# EAGLE schematic ElectricalLoads (EAGLE 9.5.1)
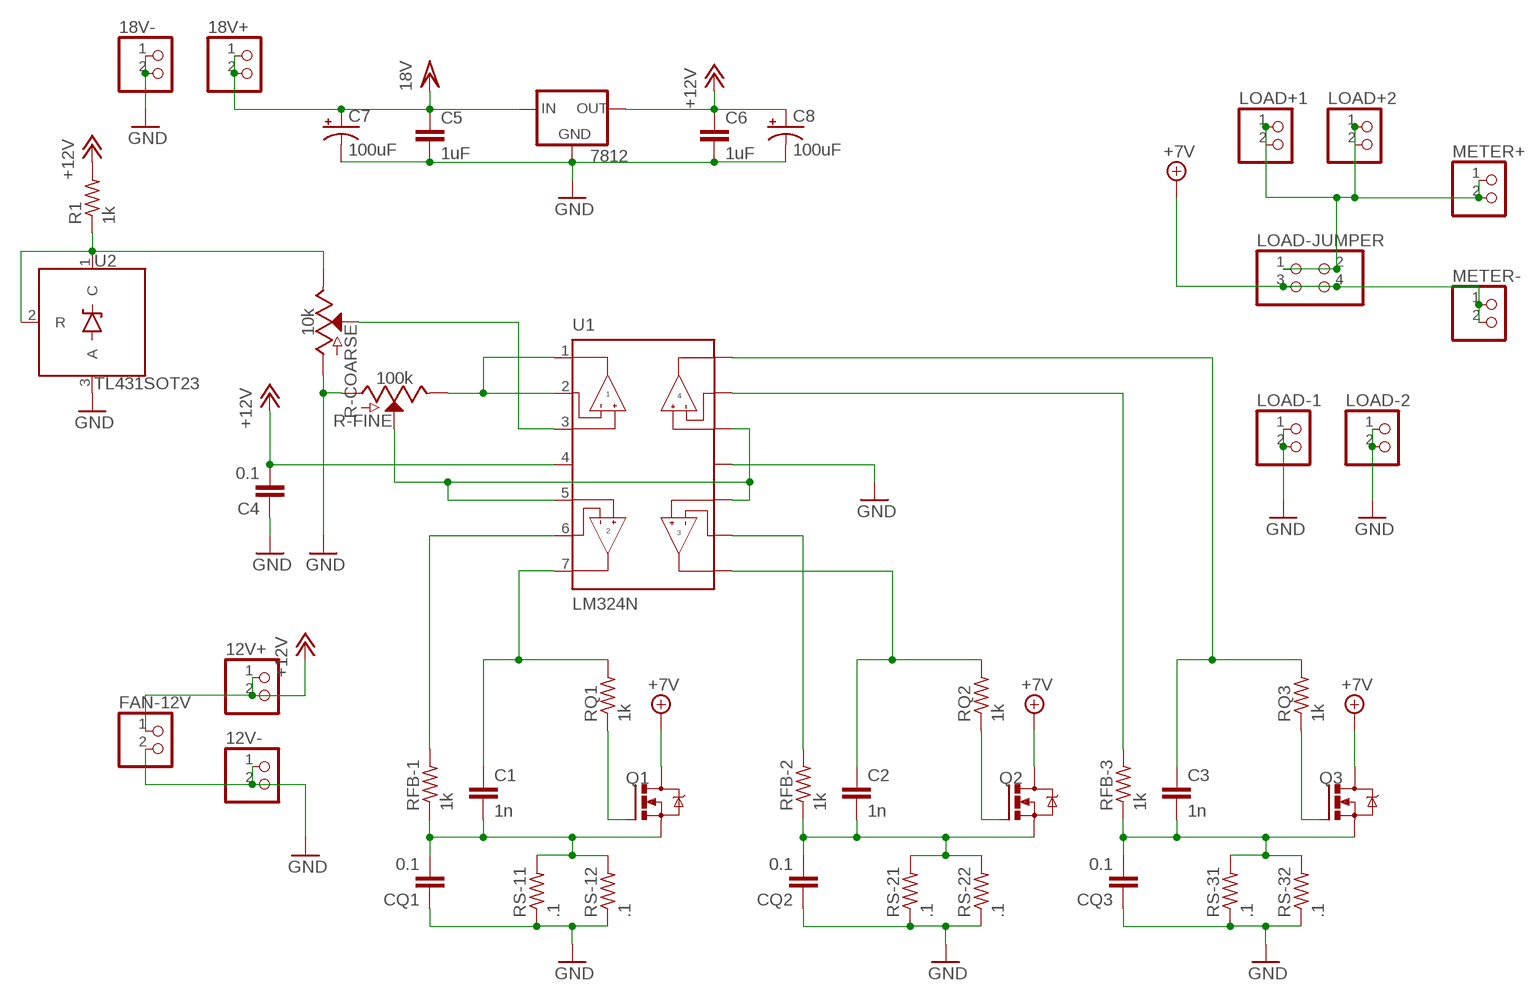
[diagram p0: schematic, sheet 1]

## Parts
12V+  PINHD-1X2  [1X02]
12V-  PINHD-1X2  [1X02]
18V+  PINHD-1X2  [1X02]
18V-  PINHD-1X2  [1X02]
7812  V_REG_78XX-TO-220  [TO-220-ALT]
C1  1n  CAP-0805  [0805]
C2  1n  CAP-0805  [0805]
C3  1n  CAP-0805  [0805]
C4  0.1  CAP-0805  [0805]
C5  1uF  10UF-1210-50V-20%  [1210]
C6  1uF  10UF-1210-50V-20%  [1210]
C7  100uF  100UF-POLAR-25V-20%(ELEC)  [PANASONIC_D]
C8  100uF  100UF-POLAR-25V-20%(ELEC)  [PANASONIC_D]
CQ1  0.1  CAP-0805  [0805]
CQ2  0.1  CAP-0805  [0805]
CQ3  0.1  CAP-0805  [0805]
FAN-12V  PINHD-1X2  [1X02]
LOAD+1  PINHD-1X2  [1X02]
LOAD+2  PINHD-1X2  [1X02]
LOAD-1  PINHD-1X2  [1X02]
LOAD-2  PINHD-1X2  [1X02]
LOAD-JUMPER  PINHD-2X2  [2X02]
METER+  PINHD-1X2  [1X02]
METER-  PINHD-1X2  [1X02]
Q1  IRLZ44Z  [TO220BH]
Q2  IRLZ44Z  [TO220BH]
Q3  IRLZ44Z  [TO220BH]
R1  1k  R-US_M0805  [M0805]
R-COARSE  10k  POTENTIOMETER-PTH-9MM-1/20W-20%  [POT-PTH-ALPS]
R-FINE  100k  POTENTIOMETER-PTH-9MM-1/20W-20%  [POT-PTH-ALPS]
RFB-1  1k  R-US_M0805  [M0805]
RFB-2  1k  R-US_M0805  [M0805]
RFB-3  1k  R-US_M0805  [M0805]
RQ1  1k  R-US_M0805  [M0805]
RQ2  1k  R-US_M0805  [M0805]
RQ3  1k  R-US_M0805  [M0805]
RS-11  .1  R-US_M1206  [M1206]
RS-12  .1  R-US_M1206  [M1206]
RS-21  .1  R-US_M1206  [M1206]
RS-22  .1  R-US_M1206  [M1206]
RS-31  .1  R-US_M1206  [M1206]
RS-32  .1  R-US_M1206  [M1206]
U1  LM324N  [DIP762W45P254L1969H508Q14]
U2  TL431SOT23  [SOT23-3]

## Nets
+7V: LOAD-JUMPER.3 LOAD-JUMPER.4 METER-.1 METER-.2 Q1.D Q2.D Q3.D
+12V: 12V+.1 12V+.2 7812.OUT C4.2 C6.1 C8.+ FAN-12V.1 R1.2 U1.4(VCC)
GND: 12V-.1 12V-.2 18V-.1 18V-.2 7812.GND C4.1 C5.2 C6.2 C7.- C8.- CQ1.1 CQ2.1 CQ3.1 FAN-12V.2 LOAD-1.1 LOAD-1.2 LOAD-2.1 LOAD-2.2 R-COARSE.P$3(A) R-FINE.P$3(A) RS-11.1 RS-12.1 RS-21.1 RS-22.1 RS-31.1 RS-32.1 U1.11(GND) U2.3(A)
N$1: C1.2 CQ1.2 Q1.S RFB-1.1 RS-11.2 RS-12.2
N$2: Q1.G RQ1.1
N$4: C1.1 RQ1.2 U1.7(2OUT)
N$5: RFB-1.2 U1.6(2IN-)
N$6: C2.2 CQ2.2 Q2.S RFB-2.1 RS-21.2 RS-22.2
N$7: Q2.G RQ2.1
N$9: C2.1 RQ2.2 U1.8(3OUT)
N$10: RFB-2.2 U1.9(3IN-)
N$11: C3.2 CQ3.2 Q3.S RFB-3.1 RS-31.2 RS-32.2
N$12: Q3.G RQ3.1
N$13: R1.1 R-COARSE.P$1(E) U2.1(C) U2.2(R)
N$14: C3.1 RQ3.2 U1.14(4OUT)
N$15: RFB-3.2 U1.13(4IN-)
N$16: R-COARSE.P$2(S) U1.3(1IN+)
N$17: R-FINE.P$2(S) U1.5(2IN+) U1.10(3IN+) U1.12(4IN+)
N$18: R-FINE.P$1(E) U1.1(1OUT) U1.2(1IN-)
N$19: LOAD+1.1 LOAD+1.2 LOAD+2.1 LOAD+2.2 LOAD-JUMPER.1 LOAD-JUMPER.2 METER+.1 METER+.2
VCC/2: 18V+.1 18V+.2 7812.IN C5.1 C7.+ ; supply symbol labelled 18V

## Library data of the parts
12V+ 12V- 18V+ 18V- FAN-12V LOAD+1 LOAD+2 LOAD-1 LOAD-2 METER+ METER- = pinhead:PINHD-1X2: PIN HEADER
7812 = SparkFun-IC-Power:V_REG_78XX: Voltage Regulator Standard 78xx regulator. IGO (Input Ground Output). Spark Fun Electronics SKU : COM-00107; PROD_ID: VREG-08450; SF_ID: COM-00107
C1-C4 CQ1-CQ3 = SparkFun-Capacitors:CAP
C5 C6 = SparkFun-Capacitors:10UF: 10.0µF ceramic capacitors A capacitor is a passive two-terminal electrical component used to store electrical energy temporarily in an electric field.; PROD_ID: CAP-09824; VALUE: 10uF
C7 C8 = SparkFun-Capacitors:100UF-POLAR: 100µF polarized capacitors A capacitor is a passive two-terminal electrical component used to store electrical energy temporarily in an electric field.; PROD_ID: CAP-12547
LOAD-JUMPER = pinhead:PINHD-2X2: PIN HEADER
Q1-Q3 = transistor-power:IRLZ44Z: N-Channel HEXFET® Power MOSFET Logic Level AUTOMOTIVE MOSFET Source: http://www.irf.com/product-info/datasheets/data/irlz44zpbf.pdf
R1 RFB-1-RFB-3 RQ1-RQ3 RS-11 RS-12 RS-21 RS-22 RS-31 RS-32 = rcl:R-US_: RESISTOR, American symbol; SPICEPREFIX: R
R-COARSE = SparkFun-Resistors:POTENTIOMETER: Potentiometer (Pot) Three-terminal potentiometers, with an adjustable wiper and two adjustable resistors. A pot can be used to create a configurable voltage divider, or as a variable resistor. Variants ALPS_POT and ALPS_POT_KIT - PTH, breadboard compatible, 9mm square pots Rotary Potentiometer - Linear (10k ohm) <https://www.sparkfun.com/products/9288> (COM-09288) The KIT variant exposes copper on only one side of the PTH pad, so the part can only be assembled on one side of the PCB. Useful for beginner soldering kits.; PROD_ID: RES-09177; SF_SKU: COM-09288
R-FINE = SparkFun-Resistors:POTENTIOMETER: Potentiometer (Pot) Three-terminal potentiometers, with an adjustable wiper and two adjustable resistors. A pot can be used to create a configurable voltage divider, or as a variable resistor. Variants ALPS_POT and ALPS_POT_KIT - PTH, breadboard compatible, 9mm square pots Rotary Potentiometer - Linear (10k ohm) <https://www.sparkfun.com/products/9288> (COM-09288) The KIT variant exposes copper on only one side of the PTH pad, so the part can only be assembled on one side of the PCB. Useful for beginner soldering kits.; PROD_ID: RES-09177; SF_SKU: COM-09288; VALUE: 10k
U1 = LM324N:LM324N: OP Amp Quad GP ±15V/30V 14-Pin PDIP Tube; AVAILABILITY: Unavailable; DESCRIPTION: OP Amp Quad GP ±15V/30V 14-Pin PDIP Tube; MF: Texas Instruments; MP: LM324N; PACKAGE: DIP-14 STMicroelectronics; PRICE: None
U2 = SparkFun-DiscreteSemi:TL431: TL431- Voltage Reference Precision Programmable Shunt Regulator Diode Datasheet <https://cdn.sparkfun.com/datasheets/Components/General%20IC/TL431-D.pdf> SparkFun Products: TL431-Voltage Reference PTH <https://www.sparkfun.com/products/11078> SparkFun Uh-Oh Battery Level Indicator <https://www.sparkfun.com/products/11087>